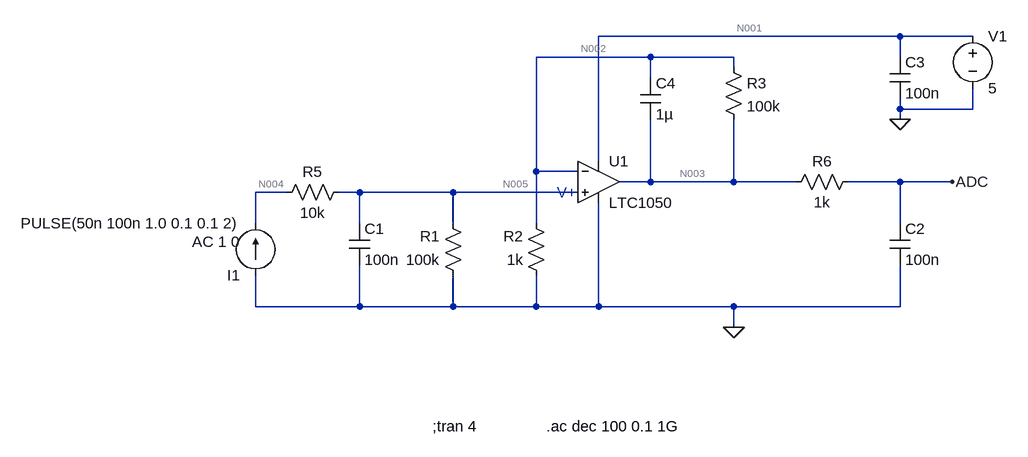
[diagram p0: schematic Draft3.asc]
Draft3.asc, the LTspice schematic file:
Version 4
SHEET 1 984 680
WIRE 816 -192 352 -192
WIRE 928 -192 816 -192
WIRE 432 -160 256 -160
WIRE 560 -160 432 -160
WIRE 816 -160 816 -192
WIRE 560 -144 560 -160
WIRE 432 -128 432 -160
WIRE 816 -80 816 -96
WIRE 928 -80 928 -112
WIRE 928 -80 816 -80
WIRE 816 -64 816 -80
WIRE 352 0 352 -192
WIRE 256 16 256 -160
WIRE 320 16 256 16
WIRE 432 32 432 -64
WIRE 432 32 384 32
WIRE 560 32 560 -64
WIRE 560 32 432 32
WIRE 656 32 560 32
WIRE 816 32 736 32
WIRE 896 32 816 32
WIRE -128 48 -176 48
WIRE -16 48 -48 48
WIRE 128 48 -16 48
WIRE 320 48 128 48
WIRE -176 96 -176 48
WIRE -16 96 -16 48
WIRE 128 96 128 48
WIRE 256 96 256 16
WIRE 816 96 816 32
WIRE -176 224 -176 176
WIRE -16 224 -16 160
WIRE -16 224 -176 224
WIRE 128 224 128 176
WIRE 128 224 -16 224
WIRE 256 224 256 176
WIRE 256 224 128 224
WIRE 352 224 352 64
WIRE 352 224 256 224
WIRE 560 224 352 224
WIRE 816 224 816 160
WIRE 816 224 560 224
WIRE 560 256 560 224
FLAG 816 -64 0
FLAG 560 256 0
FLAG 896 32 ADC
SYMBOL res -32 32 R90
WINDOW 0 0 56 VBottom 2
WINDOW 3 32 56 VTop 2
SYMATTR InstName R5
SYMATTR Value 10k
SYMBOL res 144 192 R180
WINDOW 0 36 76 Left 2
WINDOW 3 36 40 Left 2
SYMATTR InstName R1
SYMATTR Value 100k
SYMBOL res 272 192 R180
WINDOW 0 36 76 Left 2
WINDOW 3 36 40 Left 2
SYMATTR InstName R2
SYMATTR Value 1k
SYMBOL cap -32 96 R0
SYMATTR InstName C1
SYMATTR Value 100n
SYMBOL Opamps\\LTC1050 352 -32 R0
SYMATTR InstName U1
SYMBOL cap 416 -128 R0
SYMATTR InstName C4
SYMATTR Value 1µ
SYMBOL res 544 -160 R0
SYMATTR InstName R3
SYMATTR Value 100k
SYMBOL res 752 16 R90
WINDOW 0 0 56 VBottom 2
WINDOW 3 32 56 VTop 2
SYMATTR InstName R6
SYMATTR Value 1k
SYMBOL cap 800 -160 R0
SYMATTR InstName C3
SYMATTR Value 100n
SYMBOL cap 800 96 R0
SYMATTR InstName C2
SYMATTR Value 100n
SYMBOL current -176 176 R180
WINDOW 123 24 52 Left 2
WINDOW 39 0 0 Left 2
SYMATTR InstName I1
SYMATTR Value PULSE(50n 100n 1.0 0.1 0.1 2)
SYMATTR Value2 AC 1 0
SYMBOL voltage 928 -208 R0
SYMATTR InstName V1
SYMATTR Value 5
TEXT 96 408 Left 2 !;tran 4
TEXT 288 48 Left 2 ;V+
TEXT 272 408 Left 2 !.ac dec 100 0.1 1G

The netlist it stands for:
* Draft3.asc
R5 N005 N004 10k
R1 0 N005 100k
R2 0 N002 1k
C1 N005 0 100n
XU1 N005 N002 N001 0 N003 LTC1050  ; pins In+ In- V+ V- OUT
C4 N002 N003 1µ
R3 N002 N003 100k
R6 ADC N003 1k
C3 N001 0 100n
C2 ADC 0 100n
I1 0 N004 PULSE(50n 100n 1.0 0.1 0.1 2) AC 1 0
V1 N001 0 5
;tran 4
* V+
.ac dec 100 0.1 1G
.lib LTC.lib
.backanno
.end

* Results of the author's LTspice run, read from the files saved beside the schematic
* Operating Point, zero values left out:
*   V(n005) = 5 mV
*   V(n004) = 5.5 mV
*   V(n002) = 5 mV
*   V(n001) = 5 V
*   V(n003) = 505 mV
*   V(adc) = 505 mV
*   I(I1) = 50 nA
*   I(R3) = -5 µA
*   I(R2) = -5 µA
*   I(R1) = -50 nA
*   I(R5) = -50 nA
*   I(V1) = -754.1 µA
*   Ix(u1:3) = 754.1 µA
*   Ix(u1:4) = -749.1 µA
*   Ix(u1:5) = -5 µA
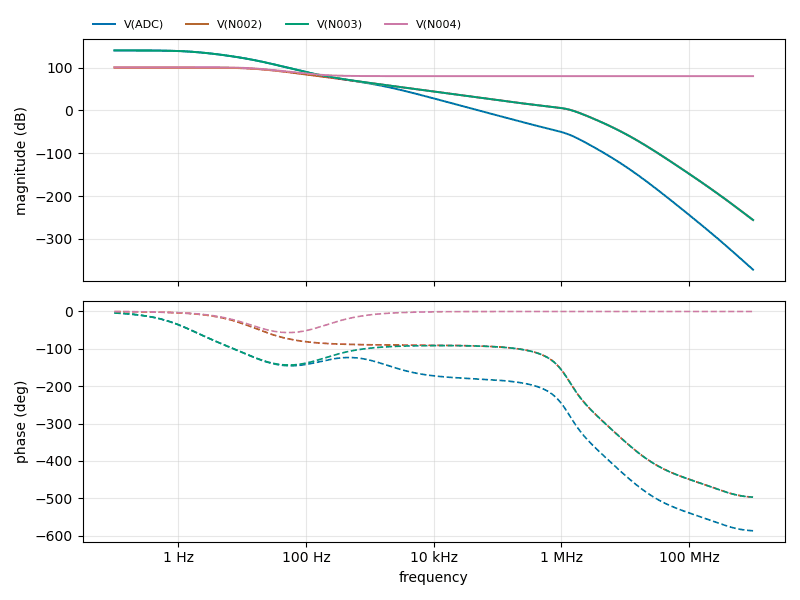
[diagram p1: AC Analysis of Draft3.asc, plotted from the saved traces]
* AC Analysis, 1 run:
*   V(ADC): 140.07 dB at 100 mHz, -371.90 dB at 1 GHz, peak 140.07 dB at 100 mHz, 3 dB below the peak at 1.582 Hz
*   V(N002): 100.00 dB at 100 mHz, -255.94 dB at 1 GHz, peak 100.00 dB at 100 mHz, 3 dB below the peak at 15.91 Hz
*   V(N003): 140.07 dB at 100 mHz, -255.94 dB at 1 GHz, peak 140.07 dB at 100 mHz, 3 dB below the peak at 1.582 Hz
*   V(N004): 100.83 dB at 100 mHz, 80.00 dB at 1 GHz, peak 100.83 dB at 100 mHz, 3 dB below the peak at 16.05 Hz